# Altium schematic sheet 云台控制板8.0.SchDoc
size A3
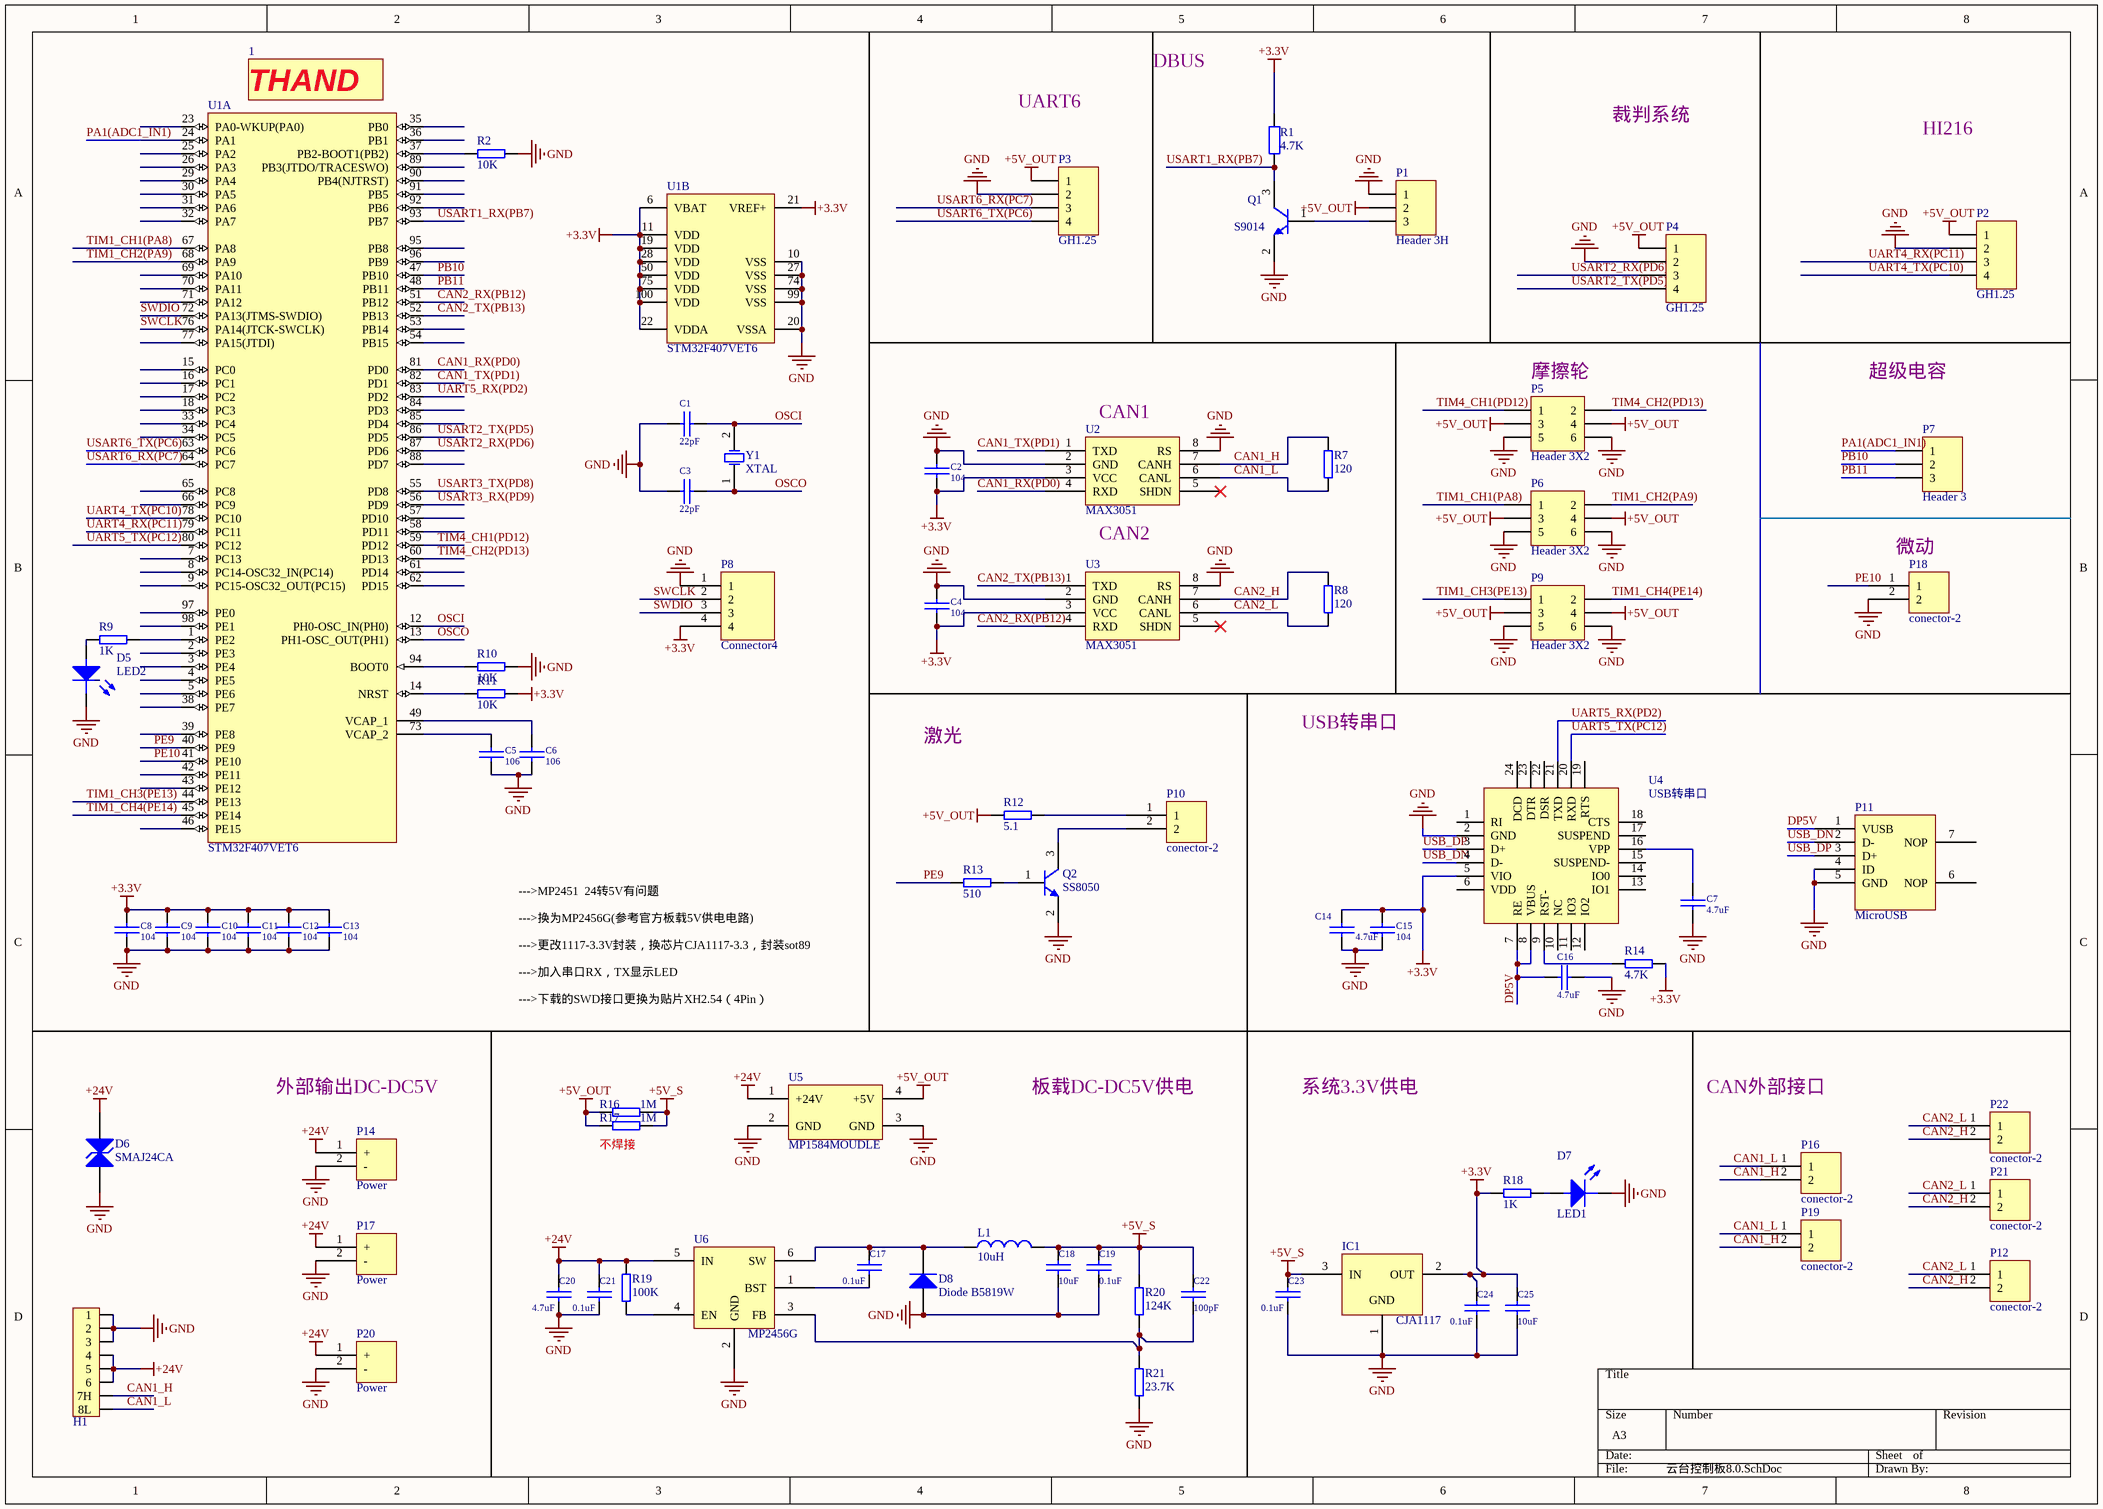
[diagram p0: 云台控制板8.0.SchDoc]

## Parts
1  (no value)  [THAND]
C1  22pF  [0805C]
C2  104  [0805C]
C3  22pF  [0805C]
C4  104  [0805C]
C5  106  [0805C]
C6  106  [0805C]
C7  4.7uF  [0805C]
C8  104  [0805C]
C9  104  [0805C]
C10  104  [0805C]
C11  104  [0805C]
C12  104  [0805C]
C13  104  [0805C]
C14  4.7uF  [0805C]
C15  104  [0805C]
C16  4.7uF  [0805C]
C17  0.1uF  [0805C]
C18  10uF  [1206C]
C19  0.1uF  [0805C]
C20  4.7uF  [1206C]
C21  0.1uF  [0805C]
C22  100pF  [0805C]
C23  0.1uF  [0805C]
C24  0.1uF  [0805C]
C25  10uF  [1206C]
D5  LED2  [0805D]
D6  SMAJ24CA  [SMA(DO-214AC)]
D7  LED1  [0805D]
D8  Diode B5819W  [SOD-123]
H1  云台电机8P  [云台电机8P]  (value not drawn)
IC1  CJA1117  [SOT89 - duplicate]
L1  value 10uH  [SMDRH63]  (hidden comment: Inductor)
P1  Header 3H  [HDR1X3H]
P2  GH1.25  [GH1.25_4P]
P3  GH1.25  [GH1.25_4P]
P4  GH1.25  [GH1.25_4P]
P5  Header 3X2  [HDR2X3]
P6  Header 3X2  [HDR2X3]
P7  Header 3  [HDR1X3]
P8  Connector4  [XH2.54-4P]
P9  Header 3X2  [HDR2X3]
P10  conector-2  [GH1.25-2P]
P11  MicroUSB  [Micro-USB沉板]
P12  conector-2  [GH1.25-2P]
P14  Power  [XT30]
P16  conector-2  [GH1.25-2P]
P17  Power  [XT30]
P18  conector-2  [GH1.25-2P]
P19  conector-2  [GH1.25-2P]
P20  Power  [XT30]
P21  conector-2  [GH1.25-2P]
P22  conector-2  [GH1.25-2P]
Q1  S9014  [SOT-23]
Q2  SS8050  [SOT-23]
R1  value 4.7K  [R0805]  (hidden comment: Res2)
R2  10K  [0805R]
R7  120  [0805R]
R8  120  [0805R]
R9  1K  [0805R]
R10  10K  [0805R]
R11  10K  [0805R]
R12  5.1  [0805R]
R13  510  [0805R]
R14  4.7K  [0805R]
R16  1M  [0805R]
R17  1M  [0805R]
R18  1K  [0805R]
R19  100K  [0805R]
R20  124K  [0805R]
R21  23.7K  [0805R]
U1  STM32F407VET6  [STM-LQFP100_N]  (parts A,B of 2)
U2  MAX3051  [SOIC8]
U3  MAX3051  [SOIC8]
U4  USB转串口  [CP2102]
U5  MP1584MOUDLE  [24-5VMP1584MOUDLE]
U6  MP2456G  [SOT23-6]
Y1  XTAL  [JZ]

## Nets
+3.3V: C2.2 C4.2 C8.1 C9.1 C10.1 C11.1 C12.1 C13.1 C14.1 C15.2 C24.1 C25.1 IC1.2(OUT) P8.4 R1.2 R11.2 R14.2 R18.1 U1.6(VBAT) U1.11(VDD) U1.19(VDD) U1.21(VREF+) U1.22(VDDA) U1.28(VDD) U1.50(VDD) U1.75(VDD) U1.100(VDD) U2.3(VCC) U3.3(VCC) U4.5(VIO)
+5V_OUT: P1.2 P2.1 P3.1 P4.1 P5.3 P5.4 P6.3 P6.4 P9.3 P9.4 R12.1 R16.1 R17.1 U5.4(+5V)
+5V_S: C18.1 C19.1 C22.1 C23.1 IC1.3(IN) L1.2 R16.2 R17.2 R20.2
+24V: C20.1 C21.1 D6.2(K) H1.4 H1.5 H1.6 P14.1(+) P17.1(+) P20.1(+) R19.2 U5.1(+24V) U6.5(IN)
GND: C1.1 C2.1 C3.1 C4.1 C5.2 C6.2 C7.1 C8.2 C9.2 C10.2 C11.2 C12.2 C13.2 C14.2 C15.1 C16.2 C18.2 C19.2 C20.2 C21.2 C23.2 C24.2 C25.2 D5.2(K) D6.1(A) D7.2(K) D8.1(A) H1.1 H1.2 H1.3 IC1.1(GND) P1.1 P2.2 P3.2 P4.2 P5.5 P5.6 P6.5 P6.6 P8.1 P9.5 P9.6 P11.4(ID) P11.5(GND) P14.2(-) P17.2(-) P18.2 P20.2(-) Q1.2(E) Q2.2(E) R2.2 R10.2 R21.1 U1.10(VSS) U1.20(VSSA) U1.27(VSS) U1.74(VSS) U1.99(VSS) U2.2(GND) U2.8(RS) U3.2(GND) U3.8(RS) U4.2(GND) U5.2(GND) U5.3(GND) U6.2(GND)
CAN1_H: H1.7(7H) P16.2 P19.2 R7.2 U2.7(CANH)
CAN1_L: H1.8(8L) P16.1 P19.1 R7.1 U2.6(CANL)
CAN1_RX(PD0): U1.81(PD0) U2.4(RXD)
CAN1_TX(PD1): U1.82(PD1) U2.1(TXD)
CAN2_H: P12.2 P21.2 P22.2 R8.2 U3.7(CANH)
CAN2_L: P12.1 P21.1 P22.1 R8.1 U3.6(CANL)
CAN2_RX(PB12): U1.51(PB12) U3.4(RXD)
CAN2_TX(PB13): U1.52(PB13) U3.1(TXD)
DP5V: C16.1 P11.1(VUSB) U4.7(RE) U4.8(VBUS)
OSCI: C1.2 U1.12(PH0-OSC_IN(PH0)) Y1.2(OSC2)
OSCO: C3.2 U1.13(PH1-OSC_OUT(PH1)) Y1.1(OSC1)
PA1(ADC1_IN1): P7.1 U1.24(PA1)
PB10: P7.2 U1.47(PB10)
PB11: P7.3 U1.48(PB11)
PE9: R13.1 U1.40(PE9)
PE10: P18.1 U1.41(PE10)
SWCLK: P8.2 U1.76(PA14(JTCK-SWCLK))
SWDIO: P8.3 U1.72(PA13(JTMS-SWDIO))
TIM1_CH1(PA8): P6.1 U1.67(PA8)
TIM1_CH2(PA9): P6.2 U1.68(PA9)
TIM1_CH3(PE13): P9.1 U1.44(PE13)
TIM1_CH4(PE14): P9.2 U1.45(PE14)
TIM4_CH1(PD12): P5.1 U1.59(PD12)
TIM4_CH2(PD13): P5.2 U1.60(PD13)
UART4_RX(PC11): P2.3 U1.79(PC11)
UART4_TX(PC10): P2.4 U1.78(PC10)
UART5_RX(PD2): U1.83(PD2) U4.21(TXD)
UART5_TX(PC12): U1.80(PC12) U4.20(RXD)
USART1_RX(PB7): Q1.3(C) R1.1 U1.93(PB7)
USART2_RX(PD6): P4.3 U1.87(PD6)
USART2_TX(PD5): P4.4 U1.86(PD5)
USART3_RX(PD9): U1.56(PD9)
USART3_TX(PD8): U1.55(PD8)
USART6_RX(PC7): P3.3 U1.64(PC7)
USART6_TX(PC6): P3.4 U1.63(PC6)
USB_DN: P11.2(D-) U4.4(D-)
USB_DP: P11.3(D+) U4.3(D+)
NetC5_1: C5.1 U1.73(VCAP_2)
NetC6_1: C6.1 U1.49(VCAP_1)
NetC7_2: C7.2 U4.16(VPP)
NetC17_1: C17.1 D8.2(K) L1.1 U6.6(SW)
NetC17_2: C17.2 U6.1(BST)
NetC22_2: C22.2 R20.1 R21.2 U6.3(FB)
NetD5_1: D5.1(A) R9.2
NetD7_1: D7.1(A) R18.2
NetP1_3: P1.3 Q1.1(B)
NetP10_1: P10.1 R12.2
NetP10_2: P10.2 Q2.3(C)
NetQ2_1: Q2.1(B) R13.2
NetR2_1: R2.1 U1.37(PB2-BOOT1(PB2))
NetR9_1: R9.1 U1.1(PE2)
NetR10_1: R10.1 U1.94(BOOT0)
NetR11_1: R11.1 U1.14(NRST)
NetR14_1: R14.1 U4.9(RST-)
NetR19_1: R19.1 U6.4(EN)

Not connected (* = marked no-connect by the designer): P11 6(NOP) 7(NOP); U1 2(PE3) 3(PE4) 4(PE5) 5(PE6) 7(PC13) 8(PC14-OSC32_IN(PC14)) 9(PC15-OSC32_OUT(PC15)) 15(PC0) 16(PC1) 17(PC2) 18(PC3) 23(PA0-WKUP(PA0)) 25(PA2) 26(PA3) 29(PA4) 30(PA5) 31(PA6) 32(PA7) 33(PC4) 34(PC5) 35(PB0) 36(PB1) 38(PE7) 39(PE8) 42(PE11) 43(PE12) 46(PE15) 53(PB14) 54(PB15) 57(PD10) 58(PD11) 61(PD14) 62(PD15) 65(PC8) 66(PC9) 69(PA10) 70(PA11) 71(PA12) 77(PA15(JTDI)) 84(PD3) 85(PD4) 88(PD7) 89(PB3(JTDO/TRACESWO)) 90(PB4(NJTRST)) 91(PB5) 92(PB6) 95(PB8) 96(PB9) 97(PE0) 98(PE1); U2 5(SHDN)*; U3 5(SHDN)*; U4 1(RI) 6(VDD) 10(NC) 11(IO3) 12(IO2) 13(IO1) 14(IO0) 15(SUSPEND-) 17(SUSPEND) 18(CTS) 19(RTS) 22(DSR) 23(DTR) 24(DCD)

## Notes on the sheet
- UART6
- DBUS
- 裁判系统
- HI216
- (near P5) 摩擦轮
- 超级电容
- (near U2) CAN1
- CAN2
- (near P18) 微动
- 激光
- USB转串口
- --->MP2451  24转5V有问题
  --->换为MP2456G(参考官方板载5V供电电路)
  --->更改1117-3.3V封装，换芯片CJA1117-3.3，封装sot89
  --->加入串口RX，TX显示LED
  --->下载的SWD接口更换为贴片XH2.54（4Pin）
  --->MP1584模块封装出问题，更换封装
- 外部输出DC-DC5V
- 板载DC-DC5V供电
- 系统3.3V供电
- CAN外部接口
- (near R17) 不焊接

## Library data of the parts
1 = THAND
C1-C25 = CAP1: Capacitor
D5 D7 = LED1: Typical RED GaAs LED; Published: 8-Jun-2000; LatestRevisionDate: 08-Jul-2005; LatestRevisionNote: Mech Layer 1 removed.; PackageReference: LED-1; Publisher: Altium Limited
D6 = Diode TVS Bi: Diode TVS 双向; Published: 8-Jun-2000; LatestRevisionDate: 17-Jul-2002; LatestRevisionNote: Re-released for DXP Platform.; PackageReference: DIODE-0.7; Publisher: Altium Limited
D8 = Diode B5819W: 1 Amp Fast Recovery Rectifier; Published: 8-Jun-2000; LatestRevisionDate: 17-Jul-2002; LatestRevisionNote: Re-released for DXP Platform.; DatasheetDocument: 1999; PackageDocument: Aug-1999; PackageReference: DO-41; Publisher: Altium Limited; Code_JEDEC: DO-204-AL; ComponentLink1Description: Manufacturer Link; ComponentLink1URL: http://www.fairchildsemi.com/; ComponentLink2Description: Datasheet; ComponentLink2URL: http://www.fairchildsemi.com/ds/1N%2F1N4934.pdf
L1 = Inductor: Code_IEC: 1005; Published: 8-Jun-2000; LatestRevisionDate: 17-Jul-2002; LatestRevisionNote: Re-released for DXP Platform.; PackageReference: 0402-A; Publisher: Altium Limited; Code_JEITA: 0402
P1 = Header 3H: Header, 3-Pin, Right Angle; LatestRevisionDate: 17-Jul-2002; LatestRevisionNote: Re-released for DXP Platform.; Publisher: Altium Limited
P2-P4 = Header 4: Header, 4-Pin; LatestRevisionDate: 17-Jul-2002; LatestRevisionNote: Re-released for DXP Platform.; Publisher: Altium Limited
P5 P6 P9 = Header 3X2: Header, 3-Pin, Dual row; LatestRevisionDate: 17-Jul-2002; LatestRevisionNote: Re-released for DXP Platform.; Publisher: Altium Limited
P7 = Header 3: Header, 3-Pin; LatestRevisionDate: 17-Jul-2002; LatestRevisionNote: Re-released for DXP Platform.; Publisher: Altium Limited
P8 = Connector4: 白色插头母头
Q1 Q2 = SS8050: NPN贴片三极管; Published: 8-Jun-2000; LatestRevisionDate: 15-Jan-2003; LatestRevisionNote: PCB Footprint 'BCY-W3/D4.7' replaced; DatasheetDocument: 1997; PackageDocument: Sep-1998; PackageReference: TO-92A; Publisher: Altium Limited; Code_JEDEC: TO-92A; ComponentLink1Description: Manufacturer Link; ComponentLink1URL: http://www.fairchildsemi.com/; ComponentLink2Description: Datasheet; ComponentLink2URL: http://www.fairchildsemi.com/ds/2N%2F2N3904.pdf
R1 = Res2: Resistor; Published: 8-Jun-2000; LatestRevisionDate: 17-Jul-2002; LatestRevisionNote: Re-released for DXP Platform.; Publisher: Altium Limited
R2 R7-R14 R16-R21 = RES: Resistance
U1 = STM32F407VET6: ARM Cortex-M4 32-bit MCU+FPU, 210 DMIPS, 512 kB Flash, 192 kB Internal RAM, 82 I/Os, 100-pin LQFP, -40 to 85 degC, Tray; Manufacturer: STMicroelectronics; D/A Converter: 2x12-bit; FLASH Size (Prog) (kB): 512; I/Os (High Current): 82; Internal RAM Size (kB): 192; Operating Frequency(F) (Processor speed) (MHz): 168; Supply Voltage(Vcc) max (V): 3.6; Supply Voltage(Vcc) min (V): 1.8; DatasheetVersion: Rev. 4; PackageVersion: Rev. 1, 06/2013; PackageReference: LQFP100; PackageDescription: 100-Pin Low Profile Quad Flat Package, 14 x 14 mm Body, 0.5 mm Pitch; Supplier 1: Digi-Key; Supplier Part Number 1: 497-12075-ND; Supplier 2: Farnell; Supplier Part Number 2: 2064367; Supplier 3: Newark; Supplier Part Number 3: 73T2332; Supplier 4: Mouser; Supplier Part Number 4: 511-STM32F407VET6; Core: ARM Cortex-M4; Packing: Tray; Mounting Technology: Surface Mount; PartNumber: STM32F407VET6; ComponentLink1Description: Manufacturer URL; ComponentLink1URL: http://www.st.com/web/en/home.html; ComponentLink2Description: Datasheet; ComponentLink2URL: http://www.st.com/st-web-ui/static/active/en/resource/technical/document/datasheet/DM00037051.pdf; ComponentLink3Description: Package Specification; ComponentLink3URL: http://www.st.com/st-web-ui/static/active/en/resource/technical/document/data_brief/DM00071938.pdf
U4 = CP2102
U5 = 24-5VMP1584MOUDLE
Y1 = XTAL: Crystal Oscillator; Published: 8-Jun-2000; LatestRevisionDate: 17-Jul-2002; LatestRevisionNote: Re-released for DXP Platform.; Publisher: Altium Limited